# EAGLE design AVRSTEPPERHW (EAGLE 5.00)

## Sheet 1 of 3
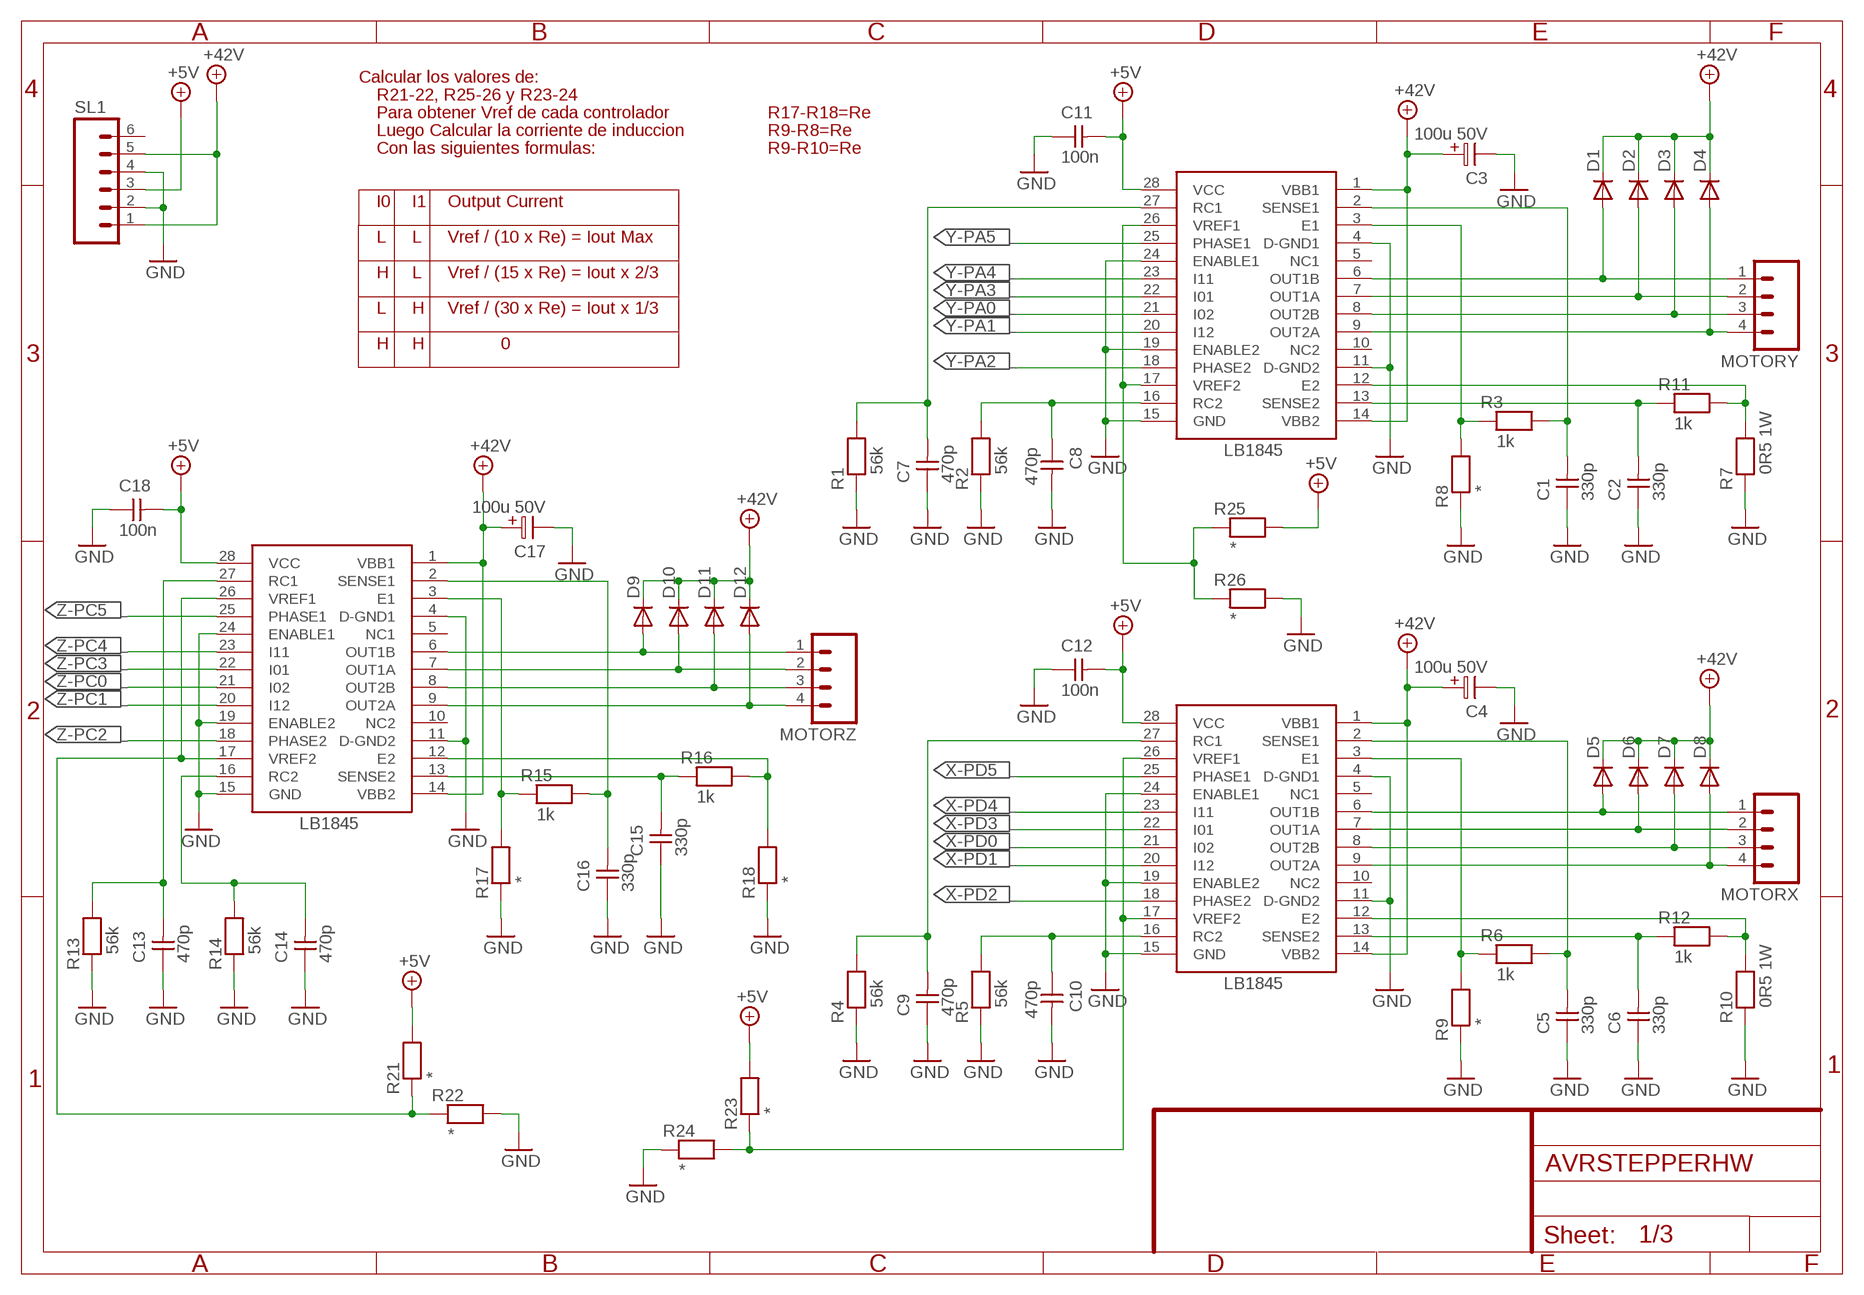
[diagram p0: schematic, sheet 1]

### Parts
C1  330p  CAPNP-2,5  [C-2,5]
C2  330p  CAPNP-2,5  [C-2,5]
C3  100u 50V  ELC-5  [ES-5]
C4  100u 50V  ELC-5  [ES-5]
C5  330p  CAPNP-2,5  [C-2,5]
C6  330p  CAPNP-2,5  [C-2,5]
C7  470p  CAPNP-2,5  [C-2,5]
C8  470p  CAPNP-2,5  [C-2,5]
C9  470p  CAPNP-2,5  [C-2,5]
C10  470p  CAPNP-2,5  [C-2,5]
C11  100n  CAPNP-5  [C-5]
C12  100n  CAPNP-5  [C-5]
C13  470p  CAPNP-2,5  [C-2,5]
C14  470p  CAPNP-2,5  [C-2,5]
C15  330p  CAPNP-2,5  [C-2,5]
C16  330p  CAPNP-2,5  [C-2,5]
C17  100u 50V  ELC-5  [ES-5]
C18  100n  CAPNP-5  [C-5]
D1  1N4004  [DO41-10]
D2  1N4004  [DO41-10]
D3  1N4004  [DO41-10]
D4  1N4004  [DO41-10]
D5  1N4004  [DO41-10]
D6  1N4004  [DO41-10]
D7  1N4004  [DO41-10]
D8  1N4004  [DO41-10]
D9  1N4004  [DO41-10]
D10  1N4004  [DO41-10]
D11  1N4004  [DO41-10]
D12  1N4004  [DO41-10]
IC1  LB1845  [DIP28H]
IC3  LB1845  [DIP28H]
IC4  LB1845  [DIP28H]
MOTORX  M04  [04P]
MOTORY  M04  [04P]
MOTORZ  M04  [04P]
R1  56k  RESEU-10  [R-10]
R2  56k  RESEU-10  [R-10]
R3  1k  RESEU-10  [R-10]
R4  56k  RESEU-10  [R-10]
R5  56k  RESEU-10  [R-10]
R6  1k  RESEU-10  [R-10]
R7  0R5 1W  RESEU-18  [R-18]
R8  *  RESEU-18  [R-18]
R9  *  RESEU-18  [R-18]
R10  0R5 1W  RESEU-18  [R-18]
R11  1k  RESEU-10  [R-10]
R12  1k  RESEU-10  [R-10]
R13  56k  RESEU-10  [R-10]
R14  56k  RESEU-10  [R-10]
R15  1k  RESEU-10  [R-10]
R16  1k  RESEU-10  [R-10]
R17  *  RESEU-18  [R-18]
R18  *  RESEU-18  [R-18]
R21  *  RESEU-10  [R-10]
R22  *  RESEU-10  [R-10]
R23  *  RESEU-10  [R-10]
R24  *  RESEU-10  [R-10]
R25  *  RESEU-10  [R-10]
R26  *  RESEU-10  [R-10]
SL1  M06  [06P]

### Nets
+5V: C11.2 C12.2 C18.2 IC1.28(VCC) IC3.28(VCC) IC4.28(VCC) R21.2 R23.2 R25.2 SL1.3 ; also sheet 2,3
+UB: C3.1 C4.1 C17.1 D1.C D2.C D3.C D4.C D5.C D6.C D7.C D8.C D9.C D10.C D11.C D12.C IC1.1(VBB1) IC1.14(VBB2) IC3.1(VBB1) IC3.14(VBB2) IC4.1(VBB1) IC4.14(VBB2) SL1.1 SL1.5 ; supply symbol labelled +42V
GND: C1.1 C2.1 C3.2 C4.2 C5.1 C6.1 C7.1 C8.2 C9.1 C10.2 C11.1 C12.1 C13.1 C14.1 C15.1 C16.1 C17.2 C18.1 IC1.4(D-GND1) IC1.11(D-GND2) IC1.15(GND) IC1.19(ENABLE2) IC1.24(ENABLE1) IC3.4(D-GND1) IC3.11(D-GND2) IC3.15(GND) IC3.19(ENABLE2) IC3.24(ENABLE1) IC4.4(D-GND1) IC4.11(D-GND2) IC4.15(GND) IC4.19(ENABLE2) IC4.24(ENABLE1) R1.1 R2.1 R4.1 R5.1 R7.1 R8.1 R9.1 R10.1 R13.1 R14.1 R17.1 R18.1 R22.2 R24.1 R26.2 SL1.2 SL1.4 ; also sheet 2,3
N$1: D5.A IC3.6(OUT1B) MOTORX.1
N$2: D6.A IC3.7(OUT1A) MOTORX.2
N$3: D7.A IC3.8(OUT2B) MOTORX.3
N$4: D8.A IC3.9(OUT2A) MOTORX.4
N$5: C1.2 IC1.2(SENSE1) R3.2
N$6: IC1.3(E1) R3.1 R8.2
N$7: D1.A IC1.6(OUT1B) MOTORY.1
N$8: D2.A IC1.7(OUT1A) MOTORY.2
N$9: D3.A IC1.8(OUT2B) MOTORY.3
N$10: D4.A IC1.9(OUT2A) MOTORY.4
N$11: C9.2 IC3.27(RC1) R4.2
N$12: IC1.12(E2) R7.2 R11.2
N$13: D9.A IC4.6(OUT1B) MOTORZ.1
N$14: C2.2 IC1.13(SENSE2) R11.1
N$15: C10.1 IC3.16(RC2) R5.2
N$16: D10.A IC4.7(OUT1A) MOTORZ.2
N$17: D11.A IC4.8(OUT2B) MOTORZ.3
N$18: D12.A IC4.9(OUT2A) MOTORZ.4
N$19: IC1.17(VREF2) IC1.26(VREF1) R25.1 R26.1
N$21: C5.2 IC3.2(SENSE1) R6.2
N$22: IC3.3(E1) R6.1 R9.2
N$24: C6.2 IC3.13(SENSE2) R12.1
N$25: IC3.12(E2) R10.2 R12.2
N$27: IC4.12(E2) R16.2 R18.2
N$28: C15.2 IC4.13(SENSE2) R16.1
N$29: C7.2 IC1.27(RC1) R1.2
N$30: C16.2 IC4.2(SENSE1) R15.2
N$31: C8.1 IC1.16(RC2) R2.2
N$32: IC4.3(E1) R15.1 R17.2
N$34: IC3.17(VREF2) IC3.26(VREF1) R23.1 R24.2
N$35: IC4.17(VREF2) IC4.26(VREF1) R21.1 R22.1
N$37: C14.2 IC4.16(RC2) R14.2
N$39: C13.2 IC4.27(RC1) R13.2
X-PD0: IC3.21(I02) ; also sheet 2
X-PD1: IC3.20(I12) ; also sheet 2
X-PD2: IC3.18(PHASE2) ; also sheet 2
X-PD3: IC3.22(I01) ; also sheet 2
X-PD4: IC3.23(I11) ; also sheet 2
X-PD5: IC3.25(PHASE1) ; also sheet 2
Y-PA0: IC1.21(I02) ; also sheet 2
Y-PA1: IC1.20(I12) ; also sheet 2
Y-PA2: IC1.18(PHASE2) ; also sheet 2
Y-PA3: IC1.22(I01) ; also sheet 2
Y-PA4: IC1.23(I11) ; also sheet 2
Y-PA5: IC1.25(PHASE1) ; also sheet 2
Z-PC0: IC4.21(I02) ; also sheet 2
Z-PC1: IC4.20(I12) ; also sheet 2
Z-PC2: IC4.18(PHASE2) ; also sheet 2
Z-PC3: IC4.22(I01) ; also sheet 2
Z-PC4: IC4.23(I11) ; also sheet 2
Z-PC5: IC4.25(PHASE1) ; also sheet 2
Unconnected: IC1.5(NC1) IC1.10(NC2) IC3.5(NC1) IC3.10(NC2) IC4.5(NC1) IC4.10(NC2) SL1.6

### Notes on the sheet
- Calcular los valores de:
- R21-22, R25-26 y R23-24
- Para obtener Vref de cada controlador | R17-R18=Re
- Luego Calcular la corriente de induccion | R9-R8=Re
- Con las siguientes formulas: | R9-R10=Re
- I0 | I1 | Output Current
- L | L | Vref / (10 x Re) = Iout Max
- H | L | Vref / (15 x Re) = Iout x 2/3
- L | H | Vref / (30 x Re) = Iout x 1/3
- H | H | 0

## Sheet 2 of 3
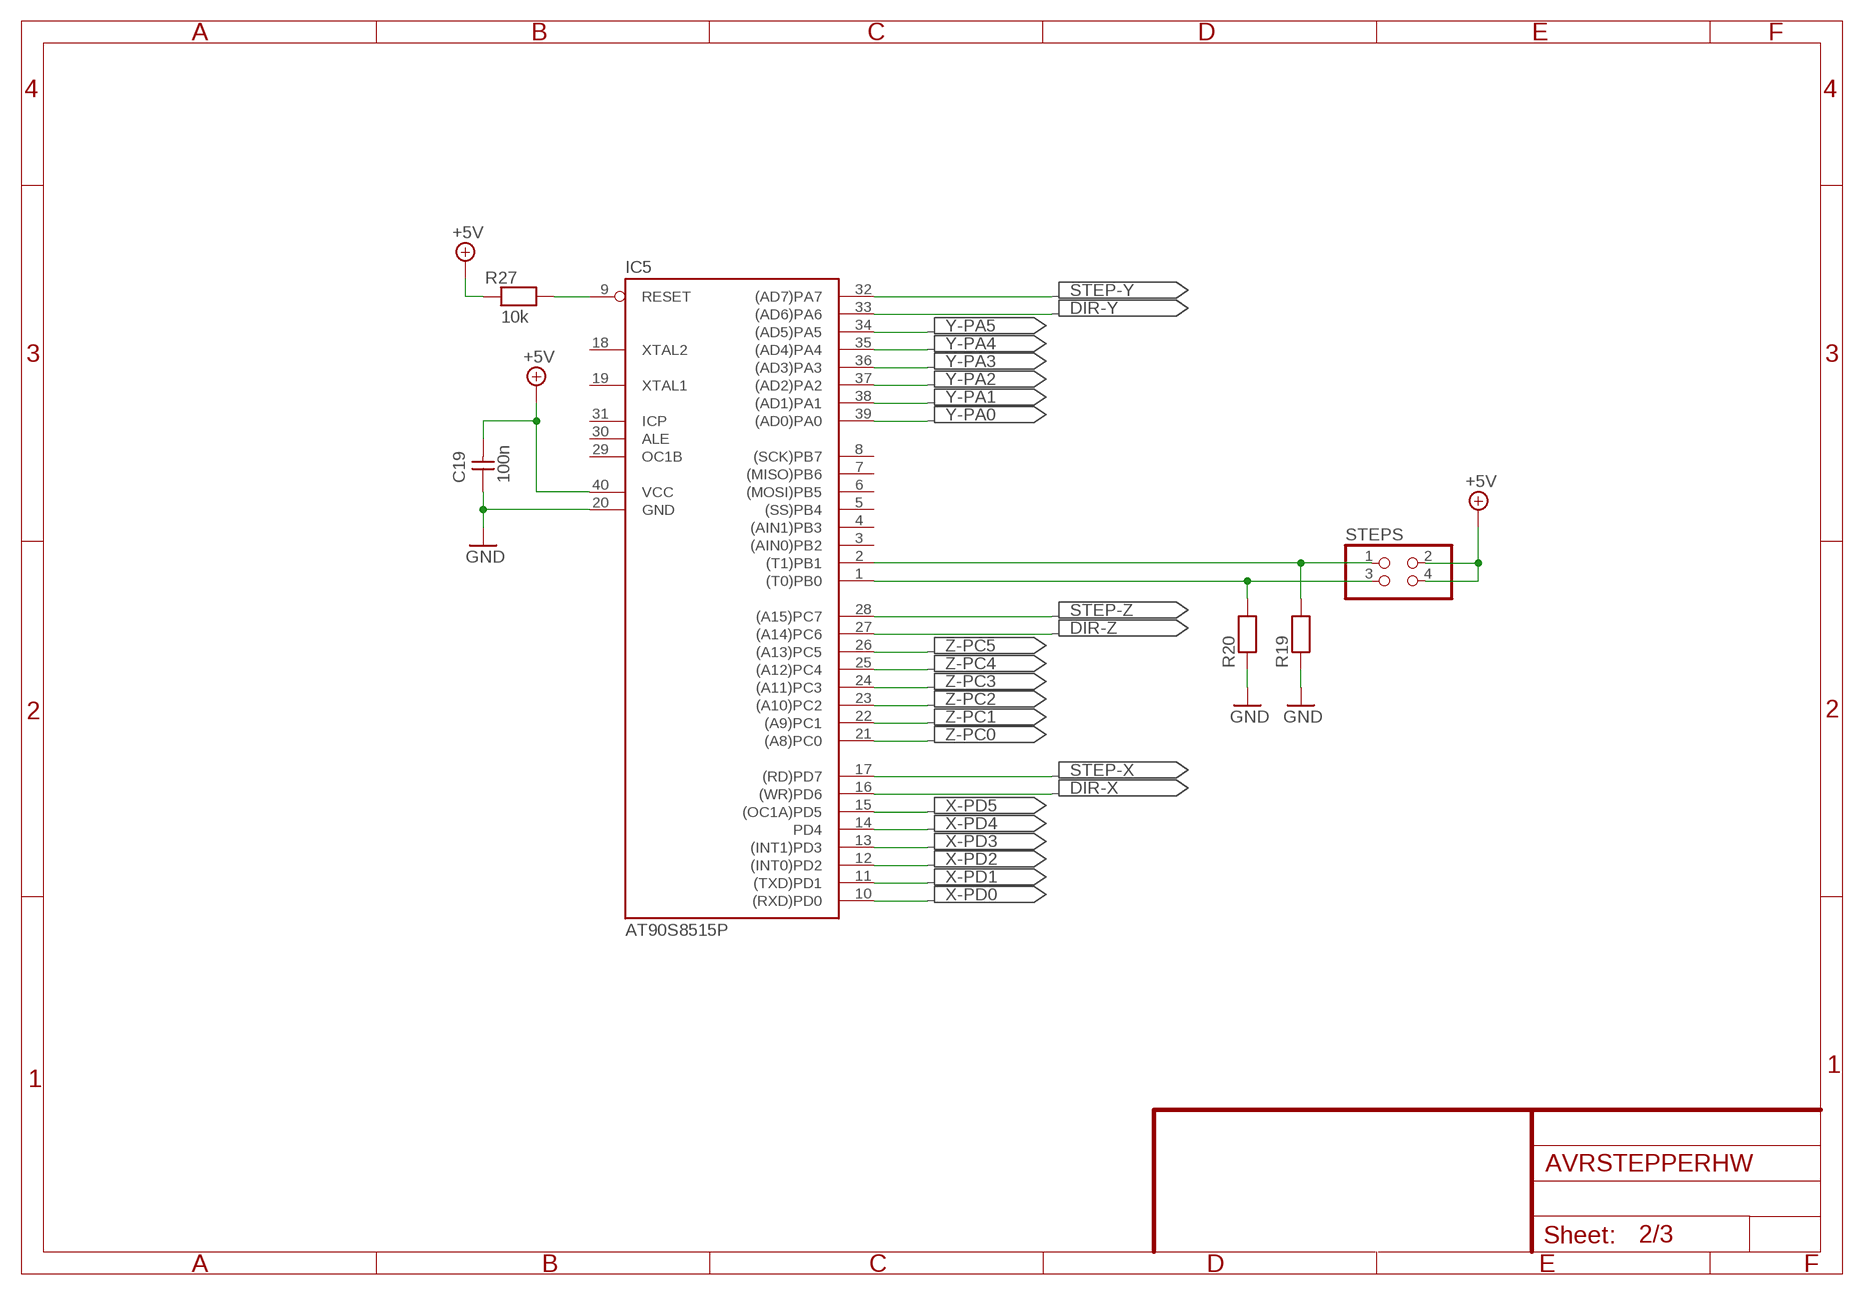
[diagram p1: schematic, sheet 2]

### Parts
C19  100n  CAPNP-5  [C-5]
IC5  AT90S8515P  [DIL40]
R19  RESEU-10  [R-10]
R20  RESEU-10  [R-10]
R27  10k  RESEU-10  [R-10]
STEPS  PINHD-2X2  [2X02]

### Nets
+5V: C19.2 IC5.40(VCC) R27.1 STEPS.2 STEPS.4 ; also sheet 1,3
DIR-X: IC5.16((WR)PD6) ; also sheet 3
DIR-Y: IC5.33((AD6)PA6) ; also sheet 3
DIR-Z: IC5.27((A14)PC6) ; also sheet 3
GND: C19.1 IC5.20(GND) R19.1 R20.1 ; also sheet 1,3
N$36: IC5.1((T0)PB0) R20.2 STEPS.3
N$38: IC5.2((T1)PB1) R19.2 STEPS.1
N$55: IC5.9(RESET) R27.2
STEP-X: IC5.17((RD)PD7) ; also sheet 3
STEP-Y: IC5.32((AD7)PA7) ; also sheet 3
STEP-Z: IC5.28((A15)PC7) ; also sheet 3
X-PD0: IC5.10((RXD)PD0) ; also sheet 1
X-PD1: IC5.11((TXD)PD1) ; also sheet 1
X-PD2: IC5.12((INT0)PD2) ; also sheet 1
X-PD3: IC5.13((INT1)PD3) ; also sheet 1
X-PD4: IC5.14(PD4) ; also sheet 1
X-PD5: IC5.15((OC1A)PD5) ; also sheet 1
Y-PA0: IC5.39((AD0)PA0) ; also sheet 1
Y-PA1: IC5.38((AD1)PA1) ; also sheet 1
Y-PA2: IC5.37((AD2)PA2) ; also sheet 1
Y-PA3: IC5.36((AD3)PA3) ; also sheet 1
Y-PA4: IC5.35((AD4)PA4) ; also sheet 1
Y-PA5: IC5.34((AD5)PA5) ; also sheet 1
Z-PC0: IC5.21((A8)PC0) ; also sheet 1
Z-PC1: IC5.22((A9)PC1) ; also sheet 1
Z-PC2: IC5.23((A10)PC2) ; also sheet 1
Z-PC3: IC5.24((A11)PC3) ; also sheet 1
Z-PC4: IC5.25((A12)PC4) ; also sheet 1
Z-PC5: IC5.26((A13)PC5) ; also sheet 1
Unconnected: IC5.3((AIN0)PB2) IC5.4((AIN1)PB3) IC5.5((SS)PB4) IC5.6((MOSI)PB5) IC5.7((MISO)PB6) IC5.8((SCK)PB7) IC5.18(XTAL2) IC5.19(XTAL1) IC5.29(OC1B) IC5.30(ALE) IC5.31(ICP)

## Sheet 3 of 3
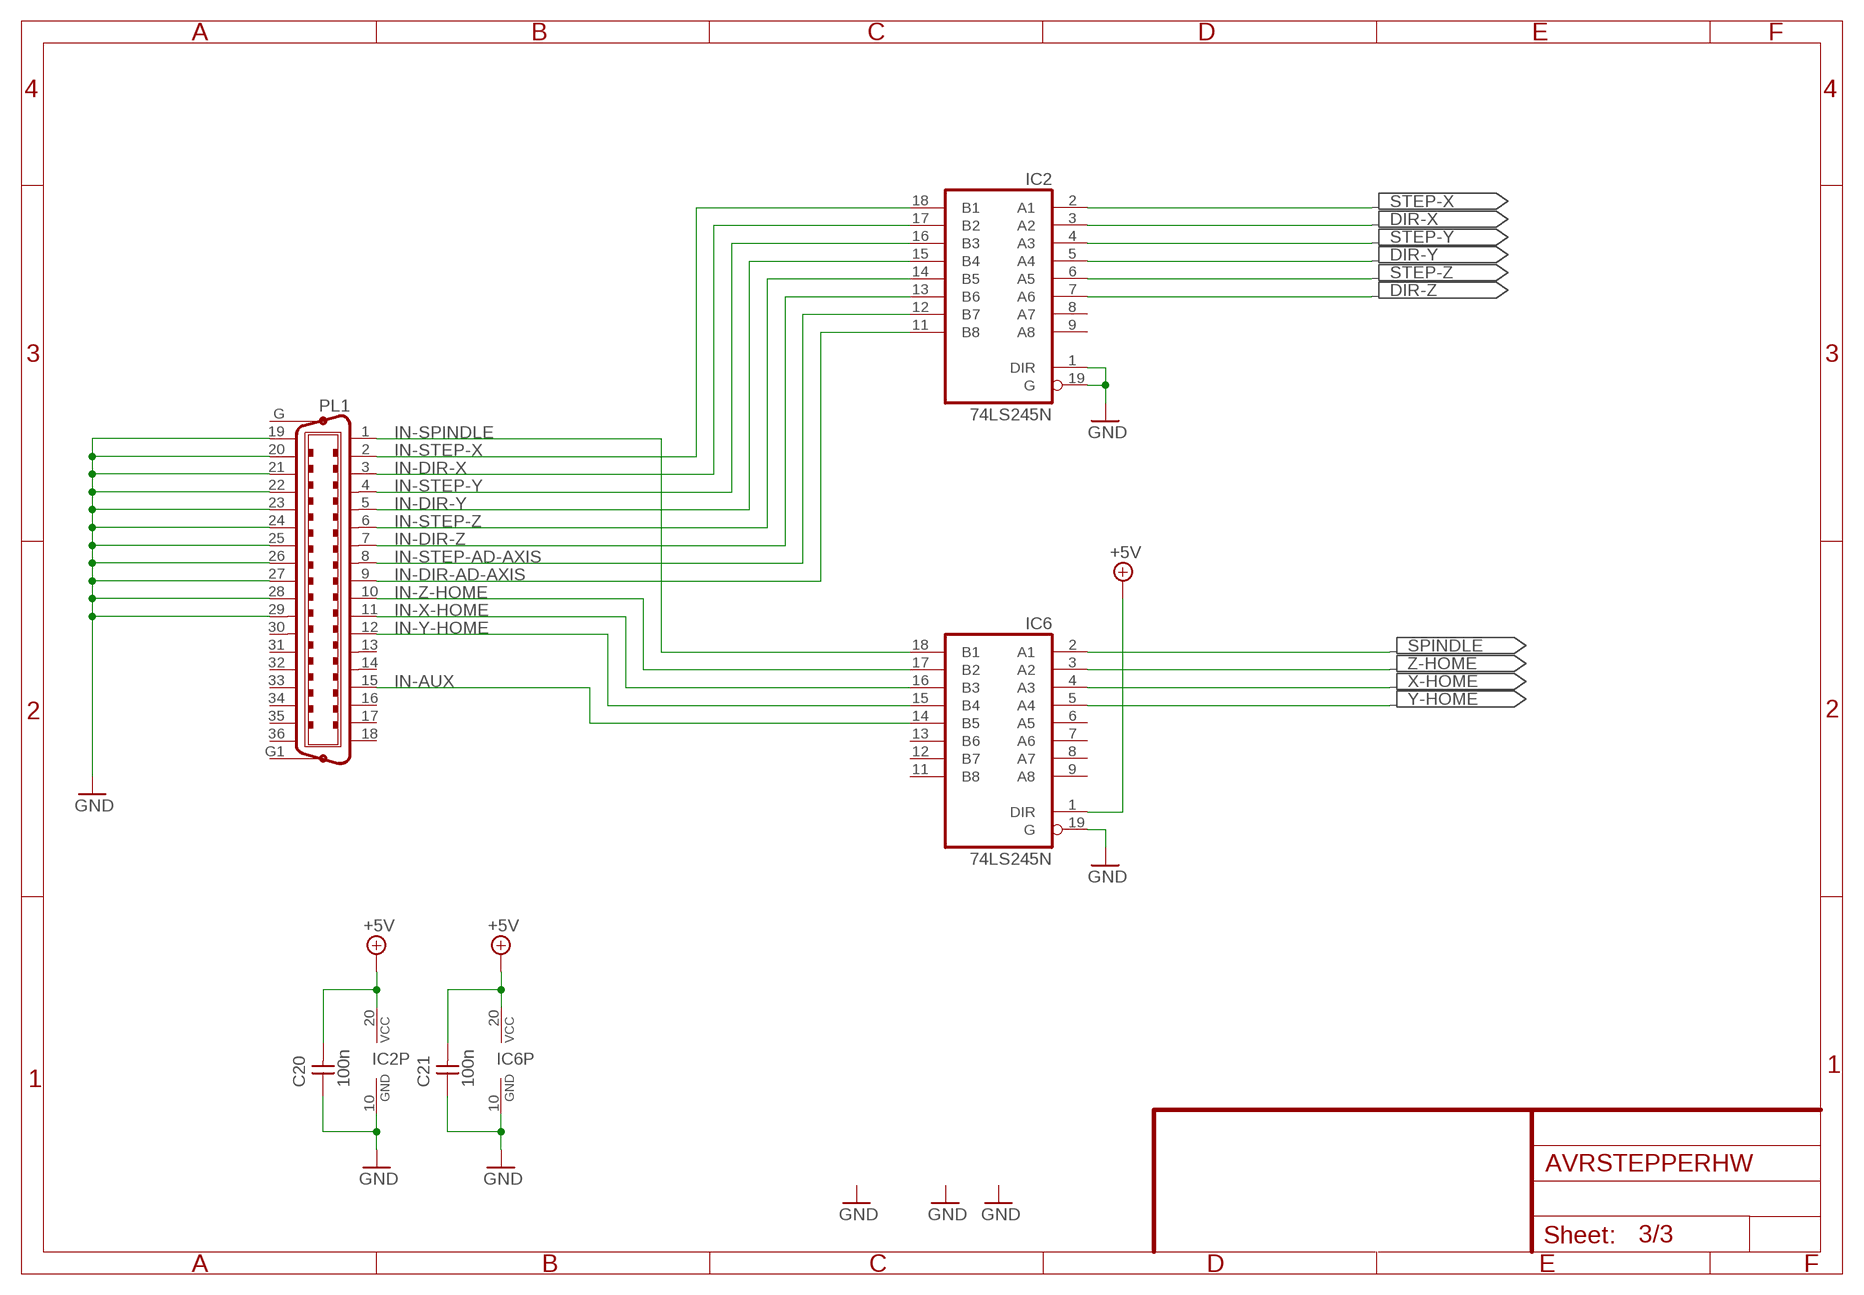
[diagram p2: schematic, sheet 3]

### Parts
C20  100n  CAPNP-5  [C-5]
C21  100n  CAPNP-5  [C-5]
IC2  74LS245N  [DIL20]
IC6  74LS245N  [DIL20]
PL1  C36HP  [36HP]

### Nets
+5V: C20.2 C21.2 IC2.20(VCC) IC6.1(DIR) IC6.20(VCC) ; also sheet 1,2
DIR-X: IC2.3(A2) ; also sheet 2
DIR-Y: IC2.5(A4) ; also sheet 2
DIR-Z: IC2.7(A6) ; also sheet 2
GND: C20.1 C21.1 IC2.1(DIR) IC2.10(GND) IC2.19(G) IC6.10(GND) IC6.19(G) PL1.19 PL1.20 PL1.21 PL1.22 PL1.23 PL1.24 PL1.25 PL1.26 PL1.27 PL1.28 PL1.29 ; also sheet 1,2
IN-AUX: IC6.14(B5) PL1.15
IN-DIR-AD-AXIS: IC2.11(B8) PL1.9
IN-DIR-X: IC2.17(B2) PL1.3
IN-DIR-Y: IC2.15(B4) PL1.5
IN-DIR-Z: IC2.13(B6) PL1.7
IN-SPINDLE: IC6.18(B1) PL1.1
IN-STEP-AD-AXIS: IC2.12(B7) PL1.8
IN-STEP-X: IC2.18(B1) PL1.2
IN-STEP-Y: IC2.16(B3) PL1.4
IN-STEP-Z: IC2.14(B5) PL1.6
IN-X-HOME: IC6.16(B3) PL1.11
IN-Y-HOME: IC6.15(B4) PL1.12
IN-Z-HOME: IC6.17(B2) PL1.10
SPINDLE: IC6.2(A1)
STEP-X: IC2.2(A1) ; also sheet 2
STEP-Y: IC2.4(A3) ; also sheet 2
STEP-Z: IC2.6(A5) ; also sheet 2
X-HOME: IC6.4(A3)
Y-HOME: IC6.5(A4)
Z-HOME: IC6.3(A2)
Unconnected: IC2.8(A7) IC2.9(A8) IC6.6(A5) IC6.7(A6) IC6.8(A7) IC6.9(A8) IC6.11(B8) IC6.12(B7) IC6.13(B6) PL1.13 PL1.14 PL1.16 PL1.17 PL1.18 PL1.30 PL1.31 PL1.32 PL1.33 PL1.34 PL1.35 PL1.36 PL1.G PL1.G1

## Library data of the parts
C1 C2 C5-C10 C13-C16 = discrete:CAPNP-2,5
C3 C4 C17 = discrete:ELC-5
C11 C12 C18-C21 = discrete:CAPNP-5
D1-D12 = diode:1N4004: DIODE general purpose rectifier, 1 A
IC1 IC3 IC4 = FET:LB1845
IC2 IC6 = 74xx-eu:74*245: Octal BUS TRANSCEIVER, 3-state
IC5 = atmel:AT90S8515P: MICROCONTROLLER 8 Kbytes FLASH 512 bytes SRAM 512 bytes EEPROM UART
MOTORX MOTORY MOTORZ = con-amp-quick:M04: AMP QUICK CONNECTOR
PL1 = con-amp-champ:C36HP: CONNECTOR
R1-R6 R11-R16 R19-R27 = discrete:RESEU-10
R7-R10 R17 R18 = discrete:RESEU-18
SL1 = con-amp-quick:M06: AMP QUICK CONNECTOR
STEPS = pinhead:PINHD-2X2: PIN HEADER

## Board
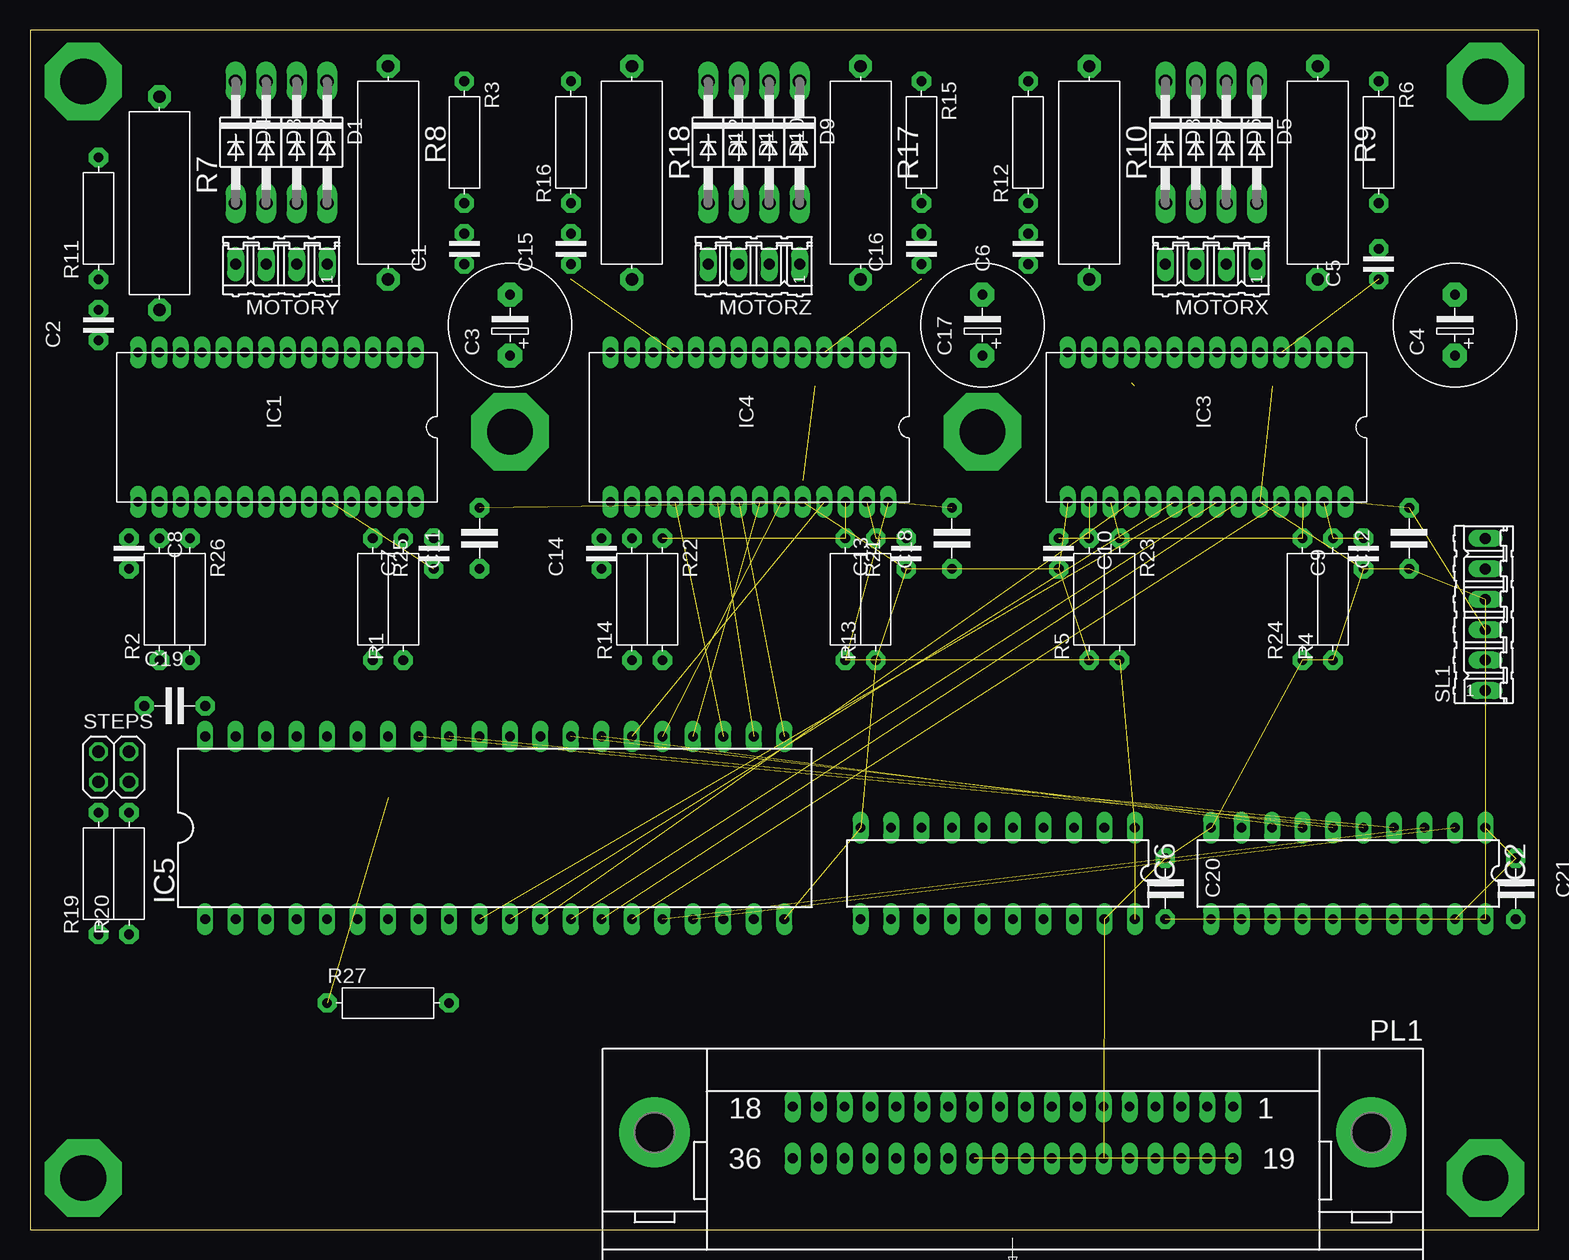
[diagram p3: board, top side]
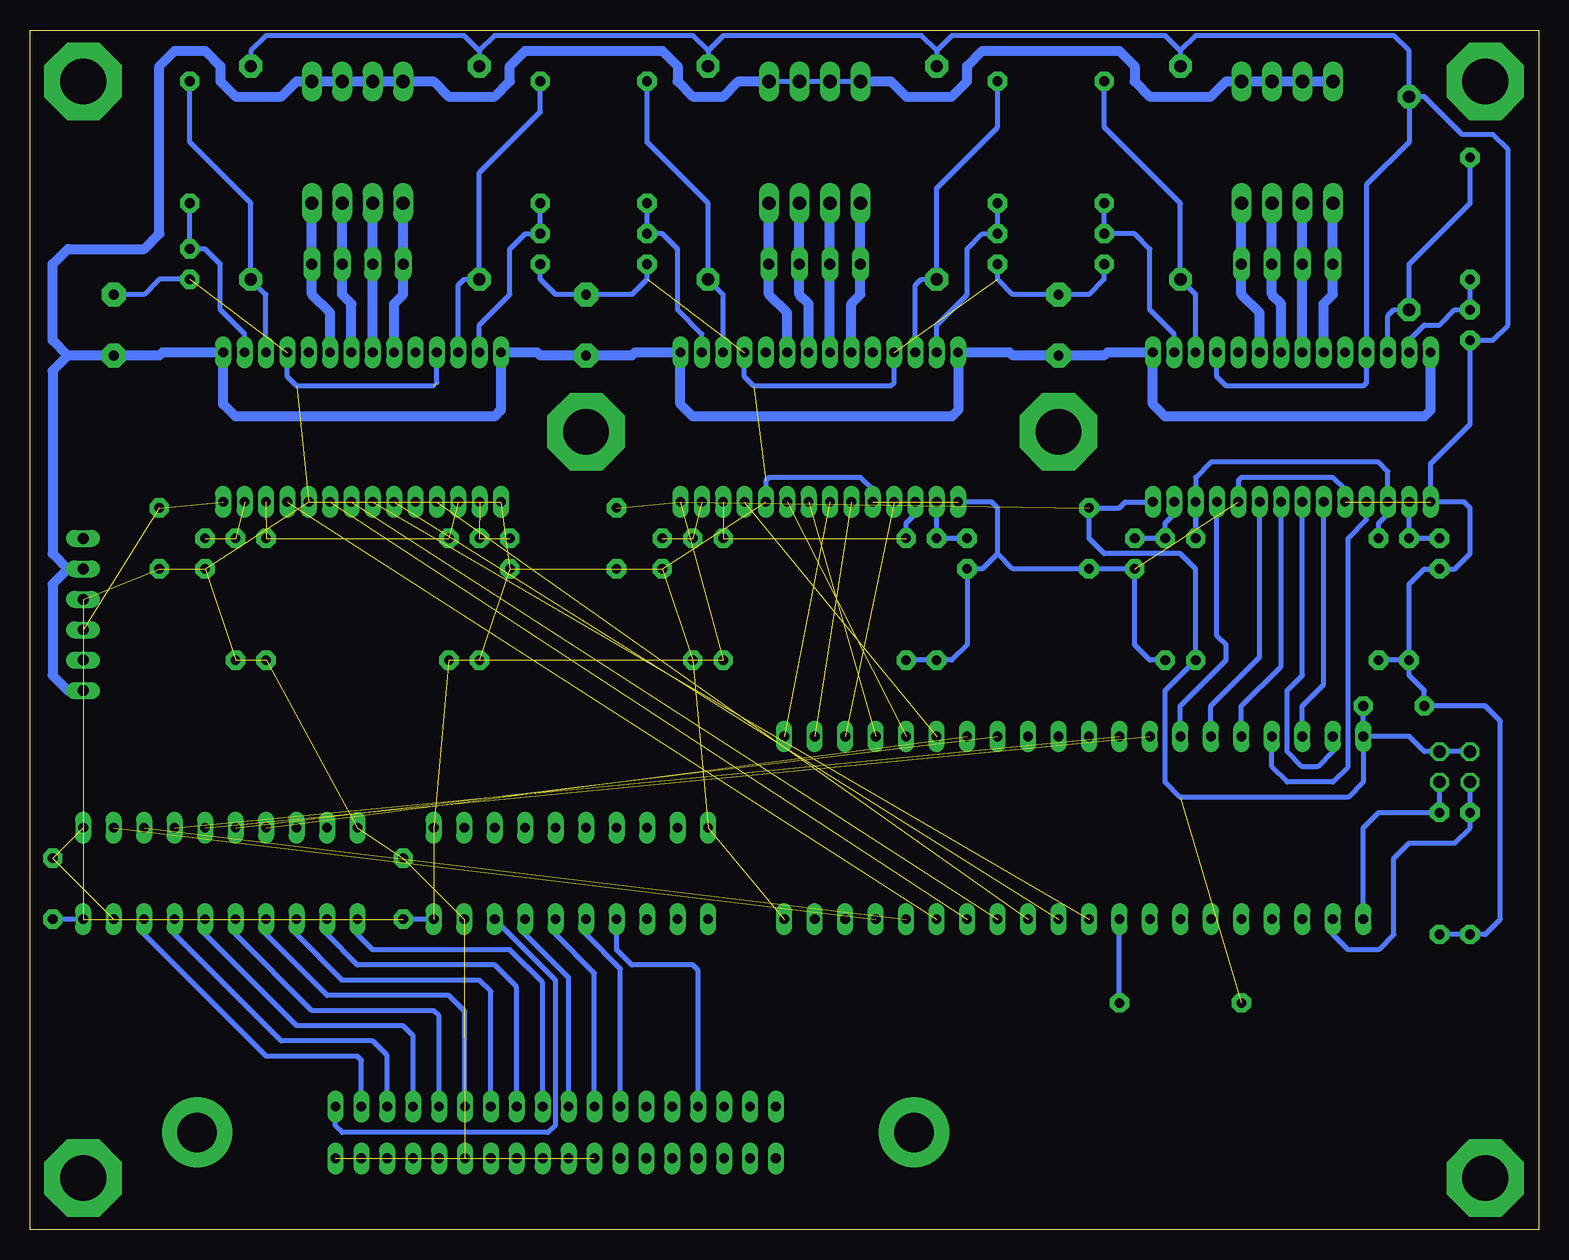
[diagram p4: board, bottom side, seen from below]

Size 125.71 x 100 mm. Coordinates in mm from the lower left corner, seen from the top.
Outline: 0,0 125.71,0 125.71,100 0,100 0,0
Copper layers 16: Bottom 0.035mm
Design rules "default": minimum track width 10mil, minimum drill 24mil, track to track 8mil, track to pad 8mil, pad to pad 8mil, via to via 8mil, smd to smd 8mil, copper to edge 40mil, drill to drill 8mil, minimum pad ring 10mil, minimum via ring 8mil, stop-mask expansion 4mil, vias tented up to drill 0mil, thermal gap 10mil

### Footprints (pad centres in the part's own frame; a part is rotated, then mirrored left to right if it is on the bottom)
C-2,5 = drill 0.813 pad 1.6 octagon: 1 -1.27,0; 2 1.27,0
ES-5 = drill 0.813 pad 2.007 octagon: 1 -2.54,0; 2 2.54,0
C-5 = drill 0.813 pad 1.6 octagon: 1 -2.54,0; 2 2.54,0
DO41-10 = drill 1.118 long: A 5.08,0; C -5.08,0
DIP28H = drill 0.813 long: 1 -5.34,12.46; 2 -5.34,10.68; 3 -5.34,8.9; 4 -5.34,7.12; 5 -5.34,5.34; 6 -5.34,3.56; 7 -5.34,1.78; 8 -5.34,0; 9 -5.34,-1.78; 10 -5.34,-3.56; 11 -5.34,-5.34; 12 -5.34,-7.12; 13 -5.34,-8.9; 14 -5.34,-10.68; 15 7.12,-10.68; 16 7.12,-8.9; 17 7.12,-7.12; 18 7.12,-5.34; 19 7.12,-3.56; 20 7.12,-1.78; 21 7.12,0; 22 7.12,1.78; 23 7.12,3.56; 24 7.12,5.34; 25 7.12,7.12; 26 7.12,8.9; 27 7.12,10.68; 28 7.12,12.46
DIL20 = drill 0.813 long: 1 -11.43,-3.81; 2 -8.89,-3.81; 3 -6.35,-3.81; 4 -3.81,-3.81; 5 -1.27,-3.81; 6 1.27,-3.81; 7 3.81,-3.81; 8 6.35,-3.81; 9 8.89,-3.81; 10 11.43,-3.81; 11 11.43,3.81; 12 8.89,3.81; 13 6.35,3.81; 14 3.81,3.81; 15 1.27,3.81; 16 -1.27,3.81; 17 -3.81,3.81; 18 -6.35,3.81; 19 -8.89,3.81; 20 -11.43,3.81
DIL40 = drill 0.813 long: 1 -24.13,-7.62; 2 -21.59,-7.62; 3 -19.05,-7.62; 4 -16.51,-7.62; 5 -13.97,-7.62; 6 -11.43,-7.62; 7 -8.89,-7.62; 8 -6.35,-7.62; 9 -3.81,-7.62; 10 -1.27,-7.62; 11 1.27,-7.62; 12 3.81,-7.62; 13 6.35,-7.62; 14 8.89,-7.62; 15 11.43,-7.62; 16 13.97,-7.62; 17 16.51,-7.62; 18 19.05,-7.62; 19 21.59,-7.62; 20 24.13,-7.62; 21 24.13,7.62; 22 21.59,7.62; 23 19.05,7.62; 24 16.51,7.62; 25 13.97,7.62; 26 11.43,7.62; 27 8.89,7.62; 28 6.35,7.62; 29 3.81,7.62; 30 1.27,7.62; 31 -1.27,7.62; 32 -3.81,7.62; 33 -6.35,7.62; 34 -8.89,7.62; 35 -11.43,7.62; 36 -13.97,7.62; 37 -16.51,7.62; 38 -19.05,7.62; 39 -21.59,7.62; 40 -24.13,7.62
04P = drill 0.914 long: 1 -3.81,0; 2 -1.27,0; 3 1.27,0; 4 3.81,0
36HP = drill 0.813 long: 1 -18.352,-2.159; 2 -16.192,-2.159; 3 -14.034,-2.159; 4 -11.874,-2.159; 5 -9.716,-2.159; 6 -7.556,-2.159; 7 -5.397,-2.159; 8 -3.239,-2.159; 9 -1.079,-2.159; 10 1.079,-2.159; 11 3.239,-2.159; 12 5.397,-2.159; 13 7.556,-2.159; 14 9.716,-2.159; 15 11.874,-2.159; 16 14.034,-2.159; 17 16.192,-2.159; 18 18.352,-2.159; 19 -18.352,2.159; 20 -16.192,2.159; 21 -14.034,2.159; 22 -11.874,2.159; 23 -9.716,2.159; 24 -7.556,2.159; 25 -5.397,2.159; 26 -3.239,2.159; 27 -1.079,2.159; 28 1.079,2.159; 29 3.239,2.159; 30 5.397,2.159; 31 7.556,2.159; 32 9.716,2.159; 33 11.874,2.159; 34 14.034,2.159; 35 16.192,2.159; 36 18.352,2.159 | drill 3.302 pad 5.842 round: G -29.87,0; G1 29.87,0
R-10 = drill 0.813 pad 1.6 octagon: 1 -5.08,0; 2 5.08,0
R-18 = drill 1.016 pad 1.905 octagon: 1 -8.89,0; 2 8.89,0
06P = drill 0.914 long: 1 -6.35,0; 2 -3.81,0; 3 -1.27,0; 4 1.27,0; 5 3.81,0; 6 6.35,0
2X02 = drill 1.016 octagon: 1 -1.27,-1.27; 2 -1.27,1.27; 3 1.27,-1.27; 4 1.27,1.27

### Placement (x,y rotation side)
C1  36.19,81.75 90 top
C2  5.71,75.4 90 top
C3  40,75.4 90 top
C4  118.74,75.4 90 top
C5  112.39,80.48 90 top
C6  83.18,81.75 90 top
C7  33.65,56.35 90 top
C8  8.25,56.35 270 top
C9  111.12,56.35 90 top
C10  85.72,56.35 270 top
C11  37.46,57.62 90 top
C12  114.93,57.62 90 top
C13  73.02,56.35 90 top
C14  47.62,56.35 90 top
C15  45.08,81.75 90 top
C16  74.29,81.75 90 top
C17  79.37,75.4 90 top
C18  76.83,57.62 90 top
C19  12.06,43.65 0 top
C20  94.61,28.41 270 top
C21  123.82,28.41 270 top
D1  24.76,90.64 270 top
D2  22.22,90.64 270 top
D3  19.68,90.64 270 top
D4  17.14,90.64 270 top
D5  102.23,90.64 270 top
D6  99.69,90.64 270 top
D7  97.15,90.64 270 top
D8  94.61,90.64 270 top
D9  64.13,90.64 270 top
D10  61.59,90.64 270 top
D11  59.05,90.64 270 top
D12  56.51,90.64 270 top
IC1  19.68,67.78 270 top
IC2  109.85,29.68 180 top
IC3  97.15,67.78 270 top
IC4  59.05,67.78 270 top
IC5  38.73,33.49 0 top
IC6  80.64,29.68 180 top
MOTORX  98.42,80.48 180 top
MOTORY  20.95,80.48 180 top
MOTORZ  60.32,80.48 180 top
PL1  81.91,8.09 180 top
R1  31.11,52.54 90 top
R2  10.79,52.54 90 top
R3  36.19,90.64 270 top
R4  108.58,52.54 90 top
R5  88.26,52.54 90 top
R6  112.39,90.64 270 top
R7  10.79,85.56 270 top
R8  29.84,88.1 270 top
R9  107.31,88.1 270 top
R10  88.26,88.1 270 top
R11  5.71,84.29 90 top
R12  83.18,90.64 90 top
R13  70.48,52.54 90 top
R14  50.16,52.54 90 top
R15  74.29,90.64 270 top
R16  45.08,90.64 90 top
R17  69.21,88.1 270 top
R18  50.16,88.1 270 top
R19  5.71,29.68 90 top
R20  8.25,29.68 90 top
R21  67.94,52.54 270 top
R22  52.7,52.54 270 top
R23  90.8,52.54 270 top
R24  106.04,52.54 90 top
R25  28.57,52.54 270 top
R26  13.33,52.54 270 top
R27  29.84,18.88 0 top
SL1  121.28,51.27 90 top
STEPS  6.98,38.57 0 top

### Tracks (layer width: path | path; a pad name or v marks a point on that pad's centre or on a via)
+5V  (11 unrouted)
  Bottom 0.406: STEPS.2 STEPS.4 9.52,39.84 10.79,41.11 IC5.40 | IC1.28 34.42,60.66 34.92,60.16 C11.2 37.46,57.62 36.19,56.35 29.84,56.35 28.57,55.08 R25.2 31.11,44.92 31.11,37.3 29.84,36.03 15.87,36.03 14.6,37.3 IC5.40 | IC5.40 C19.2 | IC6.20 C20.2 | IC2.20 C21.2
+UB
  Bottom 0.406: D12.C D11.C D10.C D9.C
  Bottom 0.813: D4.C D3.C D2.C D1.C 26.03,95.72 27.3,94.45 32.38,94.45 33.65,95.72 33.65,96.99 34.92,98.26 46.35,98.26 47.62,96.99 47.62,95.72 48.89,94.45 52.7,94.45 53.97,95.72 D12.C | 122.55,72.86 C4.1 114.93,72.86 114.67,73.12 IC3.1 109.61,68.81 108.58,67.78 86.99,67.78 86.47,68.3 IC3.14 83.44,73.12 83.18,72.86 C17.1 75.56,72.86 75.3,73.12 IC4.1 71.51,68.81 70.48,67.78 48.89,67.78 48.37,68.3 IC4.14 44.07,73.12 43.81,72.86 C3.1 36.19,72.86 35.93,73.12 IC1.1 32.14,68.81 31.11,67.78 9.52,67.78 9,68.3 IC1.14 | 122.55,72.86 123.82,71.59 123.82,56.35 122.55,55.08 | 122.55,55.08 SL1.5 | 122.55,55.08 123.82,53.81 123.82,46.19 122.55,44.92 SL1.1 | 122.55,72.86 123.82,74.13 123.82,80.48 122.55,81.75 116.2,81.75 114.93,83.02 114.93,96.99 113.66,98.26 111.12,98.26 109.85,96.99 109.85,95.72 108.58,94.45 104.77,94.45 103.5,95.72 D5.C D6.C D7.C D8.C 92.07,95.72 90.8,94.45 86.99,94.45 85.72,95.72 85.72,96.99 84.45,98.26 73.02,98.26 71.75,96.99 71.75,95.72 70.48,94.45 67.94,94.45 66.67,95.72 D9.C
DIR-X  (1 unrouted)
DIR-Y  (1 unrouted)
DIR-Z  (1 unrouted)
GND  (42 unrouted)
  Bottom 0.406: R7.1 10.79,90.64 14.34,87.09 IC1.11 14.34,70.58 14.6,70.32 26.03,70.32 26.8,71.09 IC1.4 | IC3.4 104.27,71.09 103.5,70.32 92.07,70.32 | 91.81,70.58 IC3.11 | IC4.4 66.17,71.09 65.4,70.32 53.97,70.32 53.71,70.58 IC4.11 | IC1.24 25.02,62.44 24.76,62.7 17.14,62.7 16.12,61.68 IC1.19 | IC4.24 64.39,62.44 64.13,62.7 56.51,62.7 55.49,61.68 IC4.19 | R1.1 32.38,47.46 33.65,48.73 C7.1 C11.1 43.81,55.08 45.08,56.35 | 45.08,56.35 46.35,55.08 C14.1 47.62,48.73 48.89,47.46 R14.1 R22.2 | IC4.15 45.58,60.66 45.08,60.16 45.08,56.35 | R19.1 R20.1 R19.1 | R19.1 4.44,24.6 3.17,25.87 3.17,42.38 4.44,43.65 C19.1 9.52,44.92 10.79,46.19 R2.1 | C5.1 114.93,79.21 116.2,77.94 C4.2 | C1.1 36.19,79.21 37.46,77.94 C3.2 43.81,77.94 45.08,79.21 C15.1 | 50.16,98.26 48.89,99.53 31.11,99.53 29.84,98.26 | 50.16,98.26 R18.1 | 29.84,98.26 R8.1 | 69.21,98.26 R17.1 | 69.21,98.26 67.94,99.53 51.43,99.53 50.16,98.26 | 88.26,98.26 86.99,99.53 70.48,99.53 69.21,98.26 | 88.26,98.26 R10.1 | 88.26,98.26 89.53,99.53 106.04,99.53 107.31,98.26 R9.1 | C16.1 74.29,79.21 75.56,77.94 C17.2 81.91,77.94 83.18,79.21 C6.1 | R2.1 R26.2 | R2.1 10.79,53.81 9.52,55.08 C8.2 6.98,55.08 5.71,56.35 5.71,60.16 6.21,60.66 IC1.15 9,63.85 5.71,67.14 C2.1 3.8,74.13 2.54,75.4 2.54,90 3.8,91.28 6.34,91.28 9.52,94.45 R7.1 | R7.1 10.79,98.26 12.06,99.53 28.57,99.53 29.84,98.26
IN-AUX
  Bottom 0.406: PL1.15 70.04,21.61 70.48,22.06 75.56,22.06 76.83,23.33 IC6.14
IN-DIR-AD-AXIS
  Bottom 0.406: PL1.9 82.99,20.6 85.72,23.33 97.15,23.33 98.42,24.6 IC2.11
IN-DIR-X
  Bottom 0.406: PL1.3 95.94,14.5 97.15,15.71 104.77,15.71 113.66,24.6 IC2.17
IN-DIR-Y
  Bottom 0.406: PL1.5 91.63,17.8 92.07,18.25 102.23,18.25 108.58,24.6 IC2.15
IN-DIR-Z
  Bottom 0.406: PL1.7 87.31,19.84 88.26,20.79 99.69,20.79 103.5,24.6 IC2.13
IN-SPINDLE
  Bottom 0.406: PL1.1 100.26,8.66 99.69,8.09 82.55,8.09 81.91,8.73 81.91,20.79 IC6.18
IN-STEP-AD-AXIS
  Bottom 0.406: PL1.8 85.15,20.22 86.99,22.06 98.42,22.06 100.96,24.6 IC2.12
IN-STEP-X
  Bottom 0.406: PL1.2 98.1,14.12 98.42,14.44 106.04,14.44 116.2,24.6 IC2.18
IN-STEP-Y
  Bottom 0.406: PL1.4 93.78,16.15 94.61,16.98 103.5,16.98 111.12,24.6 IC2.16
IN-STEP-Z
  Bottom 0.406: PL1.6 89.47,18.19 90.8,19.52 100.96,19.52 106.04,24.6 IC2.14
IN-X-HOME
  Bottom 0.406: PL1.11 78.67,21.36 81.91,24.6 IC6.16
IN-Y-HOME
  Bottom 0.406: PL1.12 76.51,21.74 79.37,24.6 IC6.15
IN-Z-HOME
  Bottom 0.406: PL1.10 80.83,20.98 84.45,24.6 IC6.17
N$1
  Bottom 0.813: IC3.6 100.71,76.42 102.23,77.94 MOTORX.1 D5.A
N$2
  Bottom 0.813: IC3.7 98.93,77.18 99.69,77.94 MOTORX.2 D6.A
N$3
  Bottom 0.406: IC3.8 97.15,72.86
  Bottom 0.813: IC3.8 MOTORX.3 D7.A
N$4
  Bottom 0.813: IC3.9 95.37,77.18 94.61,77.94 MOTORX.4 D8.A
N$5
  Bottom 0.406: R3.2 C1.2 33.65,83.02 32.38,81.75 32.38,76.67 30.36,74.65 IC1.2
N$6
  Bottom 0.406: R3.1 36.19,91.91 29.84,85.56 R8.2 28.58,77.95 IC1.3
N$7
  Bottom 0.813: IC1.6 23.24,76.42 24.76,77.94 MOTORY.1 D1.A
N$8
  Bottom 0.813: IC1.7 21.46,77.18 22.22,77.94 MOTORY.2 D2.A
N$9
  Bottom 0.813: IC1.8 MOTORY.3 D3.A
N$10
  Bottom 0.813: IC1.9 17.9,77.18 17.14,77.94 MOTORY.4 D4.A
N$11  (2 unrouted)
N$12
  Bottom 0.406: R11.2 5.71,85.56 10.79,80.48 R7.2 12.06,76.67 12.56,76.17 IC1.12
N$13
  Bottom 0.813: D9.A MOTORZ.1 64.13,77.94 62.61,76.42 IC4.6
N$14
  Bottom 0.406: R11.1 C2.2 6.98,76.67 8.25,75.4 9.52,75.4 10.78,74.14 IC1.13
N$15  (2 unrouted)
N$16
  Bottom 0.813: IC4.7 60.83,77.18 61.59,77.94 MOTORZ.2 D10.A
N$17
  Bottom 0.406: IC4.8 59.05,72.86
  Bottom 0.813: D11.A MOTORZ.3 IC4.8
N$18
  Bottom 0.813: IC4.9 57.27,77.18 56.51,77.94 MOTORZ.4 D12.A
N$19
  Bottom 0.406: IC1.26 R25.1 28.57,62.7 27.3,63.97 13.33,63.97 12.56,63.2 IC1.17 12.56,59.66 13.33,58.89 R26.1
N$20  (via drill 3.81 pad 6.45)
  other vias: 4.44,95.72
N$21
  Bottom 0.406: R6.2 C5.2 111.12,81.75 109.85,80.48 109.85,76.67 107.83,74.65 IC3.2
N$22
  Bottom 0.406: IC3.3 106.05,77.95 R9.2 107.31,85.56 112.39,90.64 R6.1
N$23  (via drill 3.81 pad 6.45)
  other vias: 121.28,95.72
N$24
  Bottom 0.406: R12.1 C6.2 84.45,83.02 85.72,81.75 85.72,77.94 88.26,75.4 88.26,72.86 88.25,72.87 IC3.13
N$25
  Bottom 0.406: IC3.12 90.03,78.71 89.53,79.21 R10.2 88.26,88.1 83.18,93.18 R12.2
N$26  (via drill 3.81 pad 6.45)
  other vias: 121.28,4.28
N$27
  Bottom 0.406: R16.2 45.08,91.91 50.16,86.83 R18.2 51.43,79.21 51.93,78.71 IC4.12
N$28
  Bottom 0.406: R16.1 C15.2 46.35,83.02 47.62,81.75 47.62,77.94 50.15,75.41 IC4.13
N$29
  Bottom 0.406: C7.2 R1.2 31.11,58.89 30.36,59.64 IC1.27
N$30
  Bottom 0.406: R15.2 C16.2 73.02,83.02 71.75,81.75 71.75,76.67 69.73,74.65 IC4.2
N$31
  Bottom 0.406: IC1.16 R2.2 C8.1
N$32
  Bottom 0.406: IC4.3 67.95,77.95 R17.2 69.21,85.56 74.29,90.64 R15.1
N$33  (via drill 3.81 pad 6.45)
  other vias: 4.44,4.28
N$34  (3 unrouted)
N$35  (2 unrouted)
  Bottom 0.406: IC4.17 51.93,59.66 52.7,58.89 R22.1
N$36
  Bottom 0.406: IC5.1 14.6,33.49 13.33,34.76 R20.2 STEPS.3
N$37
  Bottom 0.406: C14.2 R14.2 IC4.16
N$38
  Bottom 0.406: IC5.2 17.14,24.6 15.87,23.33 13.33,23.33 12.06,24.6 12.06,30.95 10.79,32.22 6.98,32.22 5.71,33.49 R19.2 STEPS.1
N$39  (2 unrouted)
N$40  (via drill 3.81 pad 6.45)
  other vias: 40,66.51
N$41  (via drill 3.81 pad 6.45)
  other vias: 79.37,66.51
N$55
  Bottom 0.406: R27.2 IC5.9
STEP-X  (1 unrouted)
STEP-Y  (1 unrouted)
STEP-Z  (1 unrouted)
X-PD0  (1 unrouted)
X-PD1  (1 unrouted)
X-PD2  (1 unrouted)
X-PD3  (1 unrouted)
X-PD4  (1 unrouted)
X-PD5  (1 unrouted)
Y-PA0
  Bottom 0.406: IC5.39 17.14,39.84 18.41,38.57 19.68,38.57 20.95,39.84 20.95,44.92 19.68,46.19 IC1.21
Y-PA1
  Bottom 0.406: IC1.20 17.9,45.43 19.68,43.65 IC5.38
Y-PA2
  Bottom 0.406: IC5.37 22.22,38.57 20.95,37.3 17.14,37.3 15.87,38.57 15.87,57.62 14.34,59.15 IC1.18
Y-PA3
  Bottom 0.406: IC1.22 21.46,46.95 24.76,43.65 IC5.36
Y-PA4
  Bottom 0.406: IC1.23 23.24,47.71 27.3,43.65 IC5.35
Y-PA5
  Bottom 0.406: IC1.25 26.8,49.5 26.03,48.73 26.03,47.46 29.84,43.65 IC5.34
Z-PC0  (1 unrouted)
Z-PC1  (1 unrouted)
Z-PC2  (1 unrouted)
Z-PC3  (1 unrouted)
Z-PC4  (1 unrouted)
Z-PC5  (1 unrouted)